# EAGLE schematic BlockBox v2 (EAGLE 9.5.2)

## Sheet 1 of 4: Battery
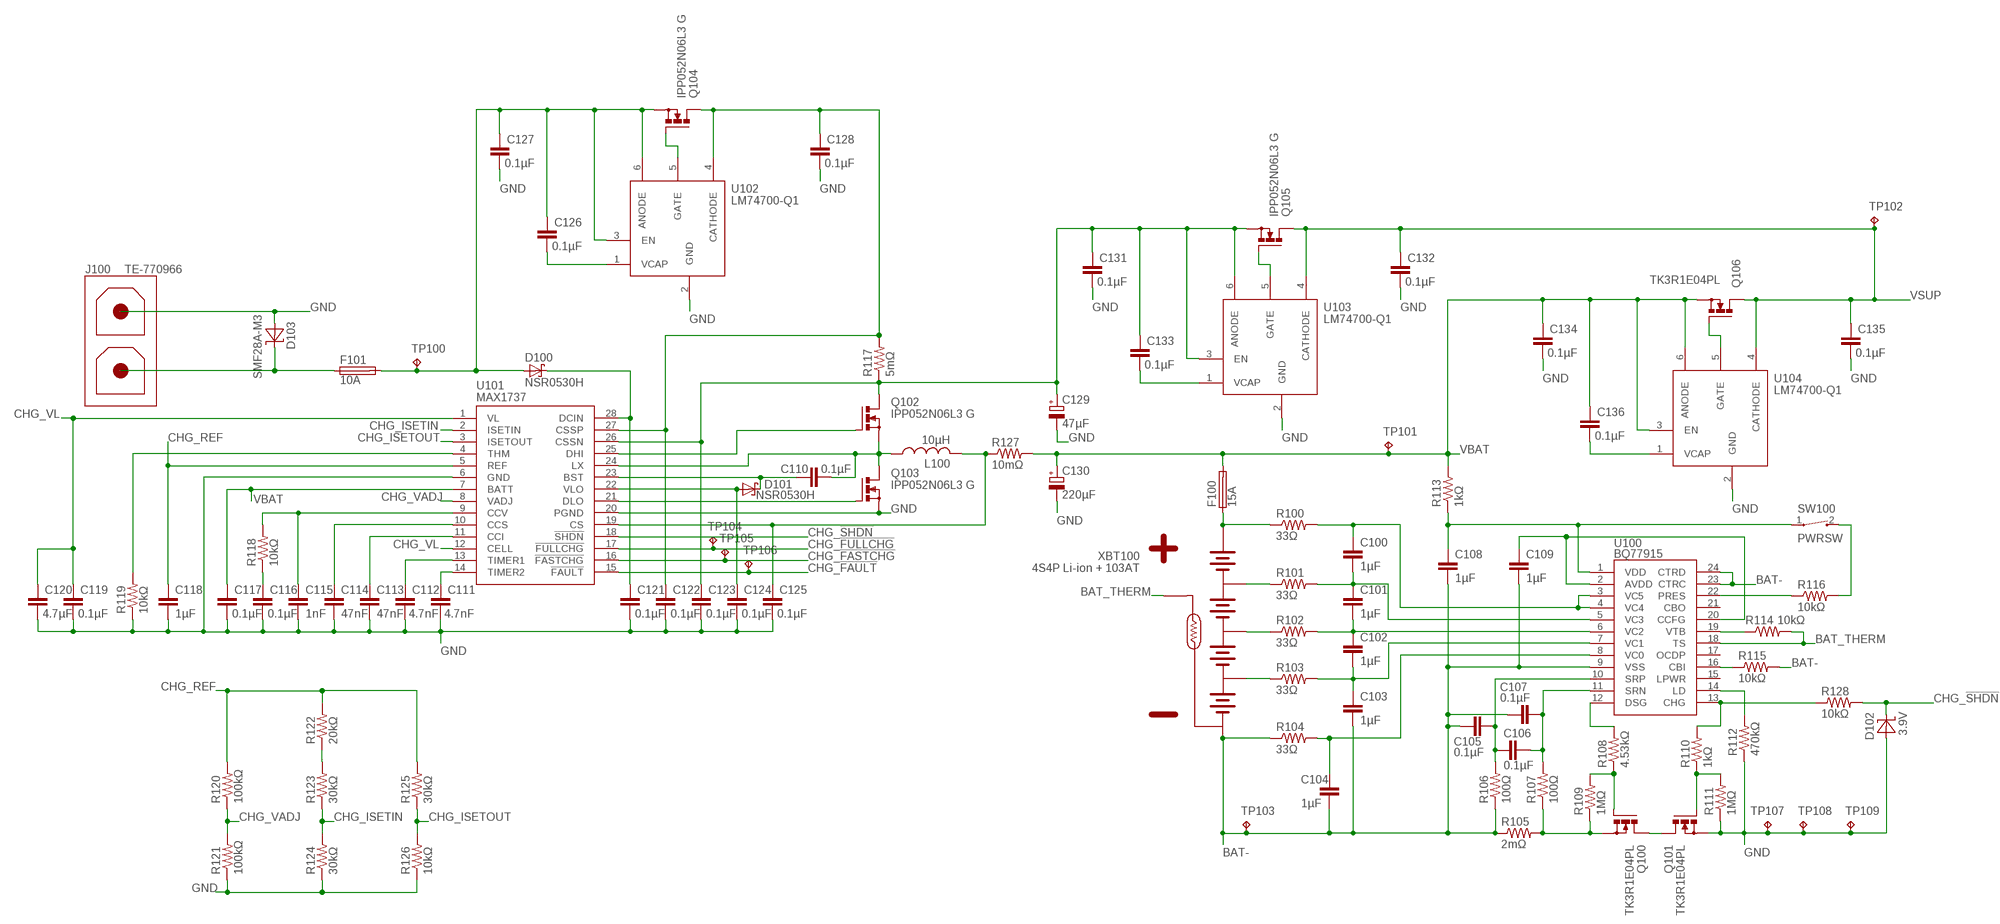
[diagram p0: schematic, sheet 1]

### Parts
C100  1µF  C-EUC0603  [C0603]
C101  1µF  C-EUC0603  [C0603]
C102  1µF  C-EUC0603  [C0603]
C103  1µF  C-EUC0603  [C0603]
C104  1µF  C-EUC0603  [C0603]
C105  0.1µF  C-EUC0603  [C0603]
C106  0.1µF  C-EUC0603  [C0603]
C107  0.1µF  C-EUC0603  [C0603]
C108  1µF  C-EUC0603  [C0603]
C109  1µF  C-EUC0603  [C0603]
C110  0.1µF  C-EUC0603  [C0603]
C111  4.7nF  C-EUC0603  [C0603]
C112  4.7nF  C-EUC0603  [C0603]
C113  47nF  C-EUC0603  [C0603]
C114  47nF  C-EUC0603  [C0603]
C115  1nF  C-EUC0603  [C0603]
C116  0.1µF  C-EUC0603  [C0603]
C117  0.1µF  C-EUC0603  [C0603]
C118  1µF  C-EUC0603  [C0603]
C119  0.1µF  C-EUC0603  [C0603]
C120  4.7µF  C-EUC0805  [C0805]
C121  0.1µF  C-EUC0603  [C0603]
C122  0.1µF  C-EUC0603  [C0603]
C123  0.1µF  C-EUC0603  [C0603]
C124  0.1µF  C-EUC0603  [C0603]
C125  0.1µF  C-EUC0603  [C0603]
C126  0.1µF  C-EUC0603  [C0603]
C127  0.1µF  C-EUC0603  [C0603]
C128  0.1µF  C-EUC0603  [C0603]
C129  47µF  CPOL-EUE2.5-6  [E2,5-6]
C130  220µF  CPOL-EUE3.5-8  [E3,5-8]
C131  0.1µF  C-EUC0603  [C0603]
C132  0.1µF  C-EUC0603  [C0603]
C133  0.1µF  C-EUC0603  [C0603]
C134  0.1µF  C-EUC0603  [C0603]
C135  0.1µF  C-EUC0603  [C0603]
C136  0.1µF  C-EUC0603  [C0603]
D100  NSR0530H  SOD323-SCHOTTKY  [SOD323]
D101  NSR0530H  SOD323-SCHOTTKY  [SOD323]
D102  3.9V  SOD323-ZENER  [SOD323]
D103  SMF28A-M3  DO-219AB-ZENER  [DO-219AB]
F100  15A  2410-FUSE  [F2410]
F101  10A  2410-FUSE  [F2410]
J100  TE-770966  [TE-770966]
L100  10µH  PM5022  [PM5022]
Q100  TK3R1E04PL  TO220BV-HS1-N-MOSFET  [TO220BV-HS1]
Q101  TK3R1E04PL  TO220BV-HS1-N-MOSFET  [TO220BV-HS1]
Q102  IPP052N06L3 G  TO220BV-HS1-N-MOSFET  [TO220BV-HS1]
Q103  IPP052N06L3 G  TO220BV-HS1-N-MOSFET  [TO220BV-HS1]
Q104  IPP052N06L3 G  TO220BV-HS1-N-MOSFET  [TO220BV-HS1]
Q105  IPP052N06L3 G  TO220BV-HS1-N-MOSFET  [TO220BV-HS1]
Q106  TK3R1E04PL  TO220BV-HS1-N-MOSFET  [TO220BV-HS1]
R100  33Ω  R-US_R0603  [R0603]
R101  33Ω  R-US_R0603  [R0603]
R102  33Ω  R-US_R0603  [R0603]
R103  33Ω  R-US_R0603  [R0603]
R104  33Ω  R-US_R0603  [R0603]
R105  2mΩ  R-US_R2512  [R2512]
R106  100Ω  R-US_R0603  [R0603]
R107  100Ω  R-US_R0603  [R0603]
R108  4.53kΩ  R-US_R0603  [R0603]
R109  1MΩ  R-US_R0603  [R0603]
R110  1kΩ  R-US_R0603  [R0603]
R111  1MΩ  R-US_R0603  [R0603]
R112  470kΩ  R-US_R0603  [R0603]
R113  1kΩ  R-US_R0603  [R0603]
R114  10kΩ  R-US_R0603  [R0603]
R115  10kΩ  R-US_R0603  [R0603]
R116  10kΩ  R-US_R0603  [R0603]
R117  5mΩ  R-US_R1206  [R1206]
R118  10kΩ  R-US_R0603  [R0603]
R119  10kΩ  R-US_R0603  [R0603]
R120  100kΩ  R-US_R0603  [R0603]
R121  100kΩ  R-US_R0603  [R0603]
R122  20kΩ  R-US_R0603  [R0603]
R123  30kΩ  R-US_R0603  [R0603]
R124  30kΩ  R-US_R0603  [R0603]
R125  30kΩ  R-US_R0603  [R0603]
R126  10kΩ  R-US_R0603  [R0603]
R127  10mΩ  R-US_R1206  [R1206]
R128  10kΩ  R-US_R0603  [R0603]
SW100  PWRSW  WIRED-SWITCH-NO  [WIRE-2P-SIMPLE]
TP100  TPTP15R  [TP15R]
TP101  TPTP15R  [TP15R]
TP102  TPTP15R  [TP15R]
TP103  TPTP15R  [TP15R]
TP104  TPTP15R  [TP15R]
TP105  TPTP15R  [TP15R]
TP106  TPTP15R  [TP15R]
TP107  TPTP15R  [TP15R]
TP108  TPTP15R  [TP15R]
TP109  TPTP15R  [TP15R]
U100  BQ77915  [TSSOP24]
U101  MAX1737  [QSOP28]
U102  LM74700-Q1  [SOT23-6L]
U103  LM74700-Q1  [SOT23-6L]
U104  LM74700-Q1  [SOT23-6L]
XBT100  4S4P Li-ion + 103AT  LI-ION-PACK-CONN  [TE-770970]

### Nets
BAT-: C103.2 C104.2 C105.1 C107.1 C108.2 C109.2 R104.1 R105.1 R106.1 R115.2 TP103.TP U100.9(VSS) U100.23(CTRC) U100.24(CTRD) XBT100.5(-) XBT100.6(-) ; also sheet 4
BAT-_INT1: Q100.S R105.2 R107.1 R109.1
BAT-_INT2: Q100.D Q101.D
BAT_AVDD: C109.1 U100.2(AVDD) U100.20(CCFG)
BAT_BAL0: C104.1 R104.2 U100.8(VC0)
BAT_BAL1: C102.2 C103.1 R103.2 U100.7(VC1)
BAT_BAL2: C101.2 C102.1 R102.2 U100.6(VC2)
BAT_BAL3: C100.2 C101.1 R101.2 U100.5(VC3)
BAT_BAL4: C100.1 R100.2 U100.3(VC5) U100.4(VC4)
BAT_CBI: R115.1 U100.16(CBI)
BAT_CHG_CTL: R110.2 R128.1 U100.13(CHG)
BAT_CHG_GATE: Q101.G R110.1 R111.2
BAT_CSN: C106.2 C107.2 R107.2 U100.11(SRN) ; also sheet 4
BAT_CSP: C105.2 C106.1 R106.2 U100.10(SRP) ; also sheet 4
BAT_DSG_CTL: R108.2 U100.12(DSG)
BAT_DSG_GATE: Q100.G R108.1 R109.2
BAT_INT1: R103.1 XBT100.4(BAL1)
BAT_INT2: R102.1 XBT100.3(BAL2)
BAT_INT3: R101.1 XBT100.7(BAL3)
BAT_LD: R112.2 U100.14(LD)
BAT_PRES: R116.1 U100.22(PRES)
BAT_PRES_SW: R116.2 SW100.2
BAT_THERM: R114.2 U100.18(TS) XBT100.8(THERM1)
BAT_VDD: C108.1 R113.1 SW100.1 U100.1(VDD)
BAT_VTB: R114.1 U100.19(VTB)
CHG_!FASTCHG: TP105.TP U101.16(!FASTCHG) ; also sheet 4
CHG_!FAULT: TP106.TP U101.15(!FAULT) ; also sheet 4
CHG_!FULLCHG: TP104.TP U101.17(!FULLCHG) ; also sheet 4
CHG_!SHDN: D102.1(C) R128.2 U101.18(!SHDN)
CHG_BST: C110.1 D101.1(C) U101.23(BST)
CHG_CCI: C113.1 U101.11(CCI)
CHG_CCS: C114.1 U101.10(CCS)
CHG_CCV: C115.1 R118.2 U101.9(CCV)
CHG_CCV_FILT: C116.1 R118.1
CHG_CS: C125.1 L100.2 R127.1 U101.19(CS)
CHG_CSSN: C123.1 C129.+ C131.1 C133.1 Q102.D Q105.S R117.1 U101.26(CSSN) U103.3(EN) U103.6(ANODE)
CHG_CSSP: C122.1 C128.1 Q104.D R117.2 U101.27(CSSP) U102.4(CATHODE)
CHG_DCIN: C121.1 D100.1(C) U101.28(DCIN)
CHG_DHI: Q102.G U101.25(DHI)
CHG_DLO: Q103.G U101.21(DLO)
CHG_ISETIN: R123.1 R124.2 U101.2(ISETIN)
CHG_ISETIN_INT: R122.1 R123.2
CHG_ISETOUT: R125.1 R126.2 U101.3(ISETOUT)
CHG_LX: C110.2 L100.1 Q102.S Q103.D U101.24(LX)
CHG_REF: C118.1 R120.2 R122.2 R125.2 U101.5(REF)
CHG_THM: R119.2 U101.4(THM)
CHG_TIMER1: C112.1 U101.13(TIMER1)
CHG_TIMER2: C111.1 U101.14(TIMER2)
CHG_VADJ: R120.1 R121.2 U101.8(VADJ)
CHG_VL: C119.1 C120.1 U101.1(VL) U101.12(CELL)
CHG_VLO: C124.1 D101.2(A) U101.22(VLO)
GND: C111.2 C112.2 C113.2 C114.2 C115.2 C116.2 C117.2 C118.2 C119.2 C120.2 C121.2 C122.2 C123.2 C124.2 C125.2 C127.2 C128.2 C129.- C130.- C131.2 C132.2 C134.2 C135.2 D102.2(A) D103.A J100.2 Q101.S Q103.S R111.1 R112.1 R119.1 R121.1 R124.1 R126.1 TP107.TP TP108.TP TP109.TP U101.6(GND) U101.20(PGND) U102.2(GND) U103.2(GND) U104.2(GND) ; also sheet 2,3,4
VBAT: C117.1 C130.+ C134.1 C136.1 F100.2 Q106.S R113.2 R127.2 TP101.TP U101.7(BATT) U104.3(EN) U104.6(ANODE) ; also sheet 4
VBAT_PREFUSE: F100.1 R100.1 XBT100.1(+) XBT100.2(+)
VIN_EXT: D103.K(C) F101.1 J100.1
VIN_EXT_FUSED: C126.1 C127.1 D100.2(A) F101.2 Q104.S TP100.TP U102.3(EN) U102.6(ANODE)
VIN_ID_GATE: Q104.G U102.5(GATE)
VIN_ID_VCAP: C126.2 U102.1(VCAP)
VSUP: C132.1 C135.1 Q105.D Q106.D TP102.TP U103.4(CATHODE) U104.4(CATHODE) ; also sheet 2
VSUP_ID1_GATE: Q105.G U103.5(GATE)
VSUP_ID1_VCAP: C133.2 U103.1(VCAP)
VSUP_ID2_GATE: Q106.G U104.5(GATE)
VSUP_ID2_VCAP: C136.2 U104.1(VCAP)
Unconnected: U100.15(LPWR) U100.17(OCDP) U100.21(CBO)

## Sheet 2 of 4: Power conversion
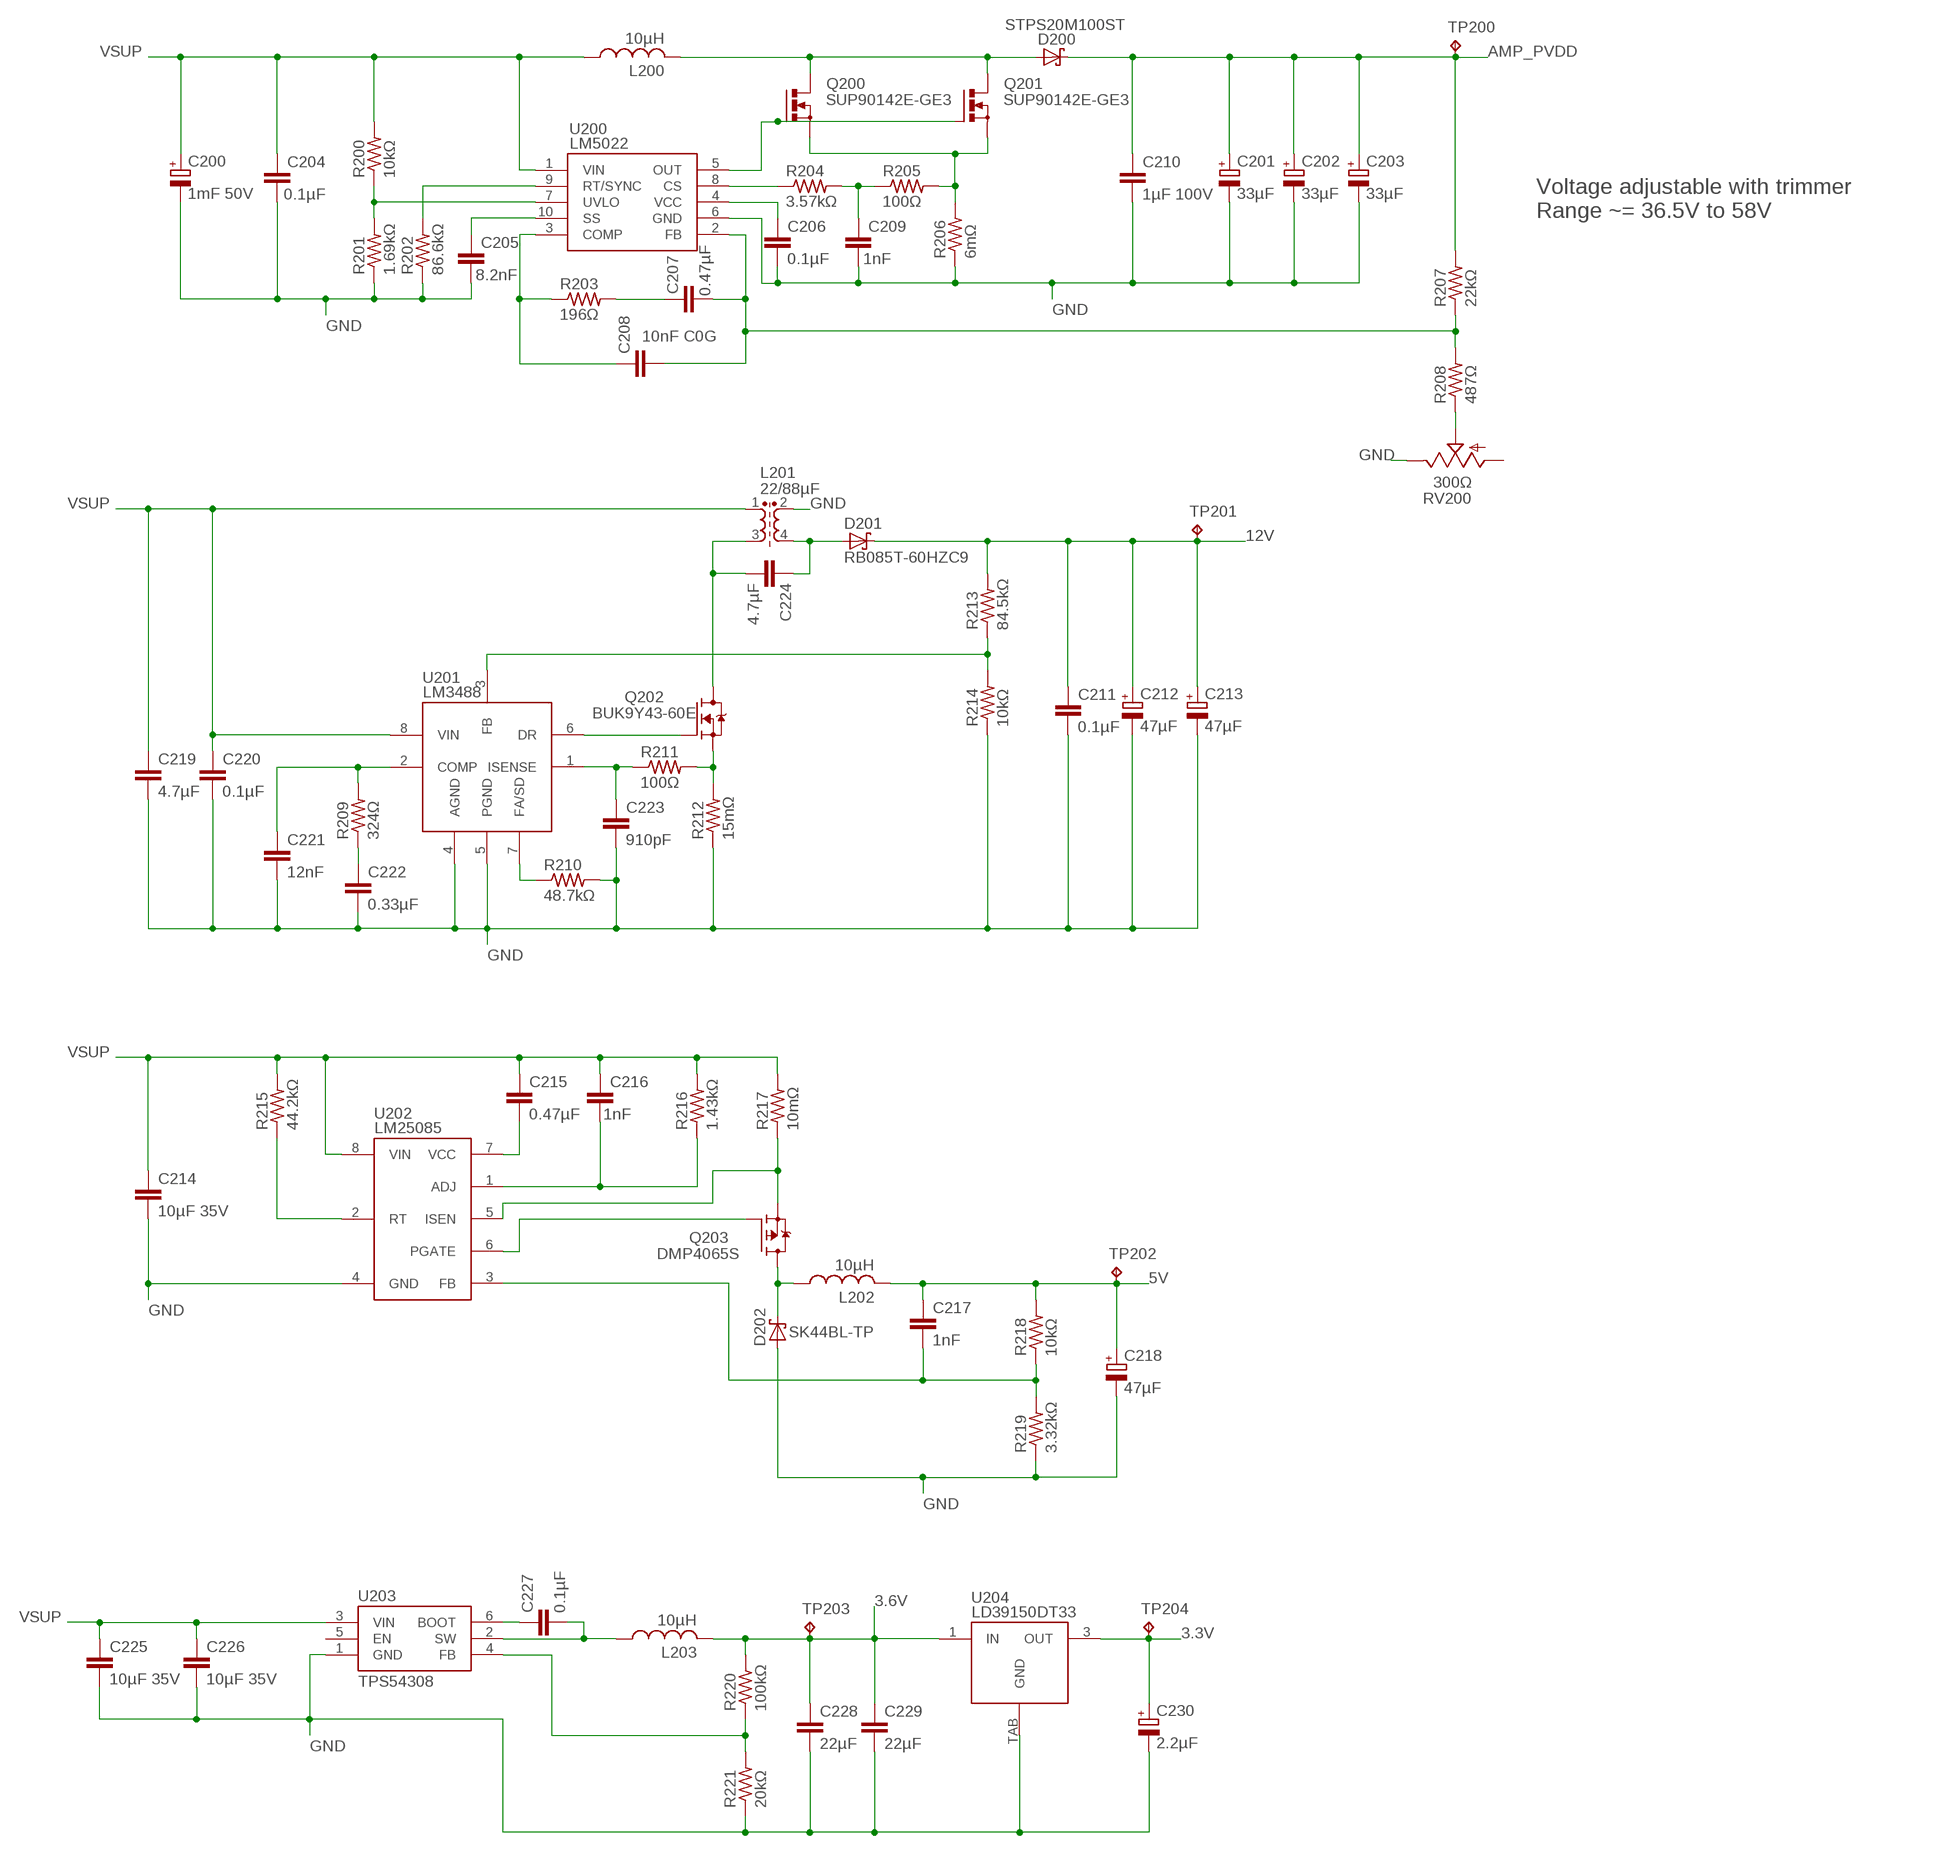
[diagram p1: schematic, sheet 2]

### Parts
C200  1mF 50V  CPOL-EUE7.5-16  [E7,5-16]
C201  33µF  CPOL-EUE3.5-8  [E3,5-8]
C202  33µF  CPOL-EUE3.5-8  [E3,5-8]
C203  33µF  CPOL-EUE3.5-8  [E3,5-8]
C204  0.1µF  C-EUC0603  [C0603]
C205  8.2nF  C-EUC0603  [C0603]
C206  0.1µF  C-EUC0603  [C0603]
C207  0.47µF  C-EU050-035X075  [C050-035X075]
C208  10nF C0G  C-EUC0603  [C0603]
C209  1nF  C-EUC0603  [C0603]
C210  1µF 100V  C-EUC1206  [C1206]
C211  0.1µF  C-EUC0603  [C0603]
C212  47µF  CPOL-EUE2.5-6  [E2,5-6]
C213  47µF  CPOL-EUE2.5-6  [E2,5-6]
C214  10µF 35V  C-EUC1206  [C1206]
C215  0.47µF  C-EUC0603  [C0603]
C216  1nF  C-EUC0603  [C0603]
C217  1nF  C-EUC0603  [C0603]
C218  47µF  CPOL-EUE2.5-6  [E2,5-6]
C219  4.7µF  C-EUC0805  [C0805]
C220  0.1µF  C-EUC0603  [C0603]
C221  12nF  C-EUC0603  [C0603]
C222  0.33µF  C-EU050-035X075  [C050-035X075]
C223  910pF  C-EUC0603  [C0603]
C224  4.7µF  C-EUC0805  [C0805]
C225  10µF 35V  C-EUC1206  [C1206]
C226  10µF 35V  C-EUC1206  [C1206]
C227  0.1µF  C-EUC0603  [C0603]
C228  22µF  C-EUC0805  [C0805]
C229  22µF  C-EUC0805  [C0805]
C230  2.2µF  CPOL-EUB  [PANASONIC_B]
D200  STPS20M100ST  TO220AB-HS1-SCHOTTKY  [TO220ABS-HS1]
D201  RB085T-60HZC9  TO220AB-HS1-SCHOTTKY  [TO220ABS-HS1]
D202  SK44BL-TP  DO-214AA-SCHOTTKY  [DO-214AA]
L200  10µH  PQ2614B  [PQ2614B]
L201  22/88µF  SRF1280A  [SRF1280A]
L202  10µH  SRN1060  [SRN1060]
L203  10µH  RLB0912  [RLB0912]
Q200  SUP90142E-GE3  TO220BV-HS1-N-MOSFET  [TO220BV-HS1]
Q201  SUP90142E-GE3  TO220BV-HS1-N-MOSFET  [TO220BV-HS1]
Q202  BUK9Y43-60E  SOT669-N-MOSFET  [SOT669]
Q203  DMP4065S  SOT23-P-MOSFET  [SOT23]
R200  10kΩ  R-US_R0603  [R0603]
R201  1.69kΩ  R-US_R0603  [R0603]
R202  86.6kΩ  R-US_R0603  [R0603]
R203  196Ω  R-US_R0603  [R0603]
R204  3.57kΩ  R-US_R0603  [R0603]
R205  100Ω  R-US_R0603  [R0603]
R206  6mΩ  R-US_R2512  [R2512]
R207  22kΩ  R-US_R0603  [R0603]
R208  487Ω  R-US_R0603  [R0603]
R209  324Ω  R-US_R0603  [R0603]
R210  48.7kΩ  R-US_R0603  [R0603]
R211  100Ω  R-US_R0603  [R0603]
R212  15mΩ  R-US_R0612  [R0612]
R213  84.5kΩ  R-US_R0603  [R0603]
R214  10kΩ  R-US_R0603  [R0603]
R215  44.2kΩ  R-US_R0603  [R0603]
R216  1.43kΩ  R-US_R0603  [R0603]
R217  10mΩ  R-US_R1206  [R1206]
R218  10kΩ  R-US_R0603  [R0603]
R219  3.32kΩ  R-US_R0603  [R0603]
R220  100kΩ  R-US_R0603  [R0603]
R221  20kΩ  R-US_R0603  [R0603]
RV200  300Ω  TC33X-2  [TC33X-2]
TP200  TPTP15R  [TP15R]
TP201  TPTP15R  [TP15R]
TP202  TPTP15R  [TP15R]
TP203  TPTP15R  [TP15R]
TP204  TPTP15R  [TP15R]
U200  LM5022  [VSSOP10]
U201  LM3488  [VSSOP8]
U202  LM25085  [VSSOP8]
U203  TPS54308  [SOT23-6L]
U204  LD39150DT33  DPAK-LDO  [DPAK]

### Nets
3.3V: C230.+ TP204.TP U204.3(OUT) ; also sheet 3,4
3.6V: C228.1 C229.1 L203.2 R220.2 TP203.TP U204.1(IN)
5V: C217.1 C218.+ L202.2 R218.2 TP202.TP ; also sheet 4
12V: C211.1 C212.+ C213.+ D201.C R213.2 TP201.TP ; also sheet 3,4
AMP_PVDD: C201.+ C202.+ C203.+ C210.1 D200.C R207.2 TP200.TP ; also sheet 3
BOOST_COMP: C208.1 R203.1 U200.3(COMP)
BOOST_COMP_INT: C207.1 R203.2
BOOST_CS: R204.1 U200.8(CS)
BOOST_CS_FILTER: C209.1 R204.2 R205.1
BOOST_FB: C207.2 C208.2 R207.1 R208.2 U200.2(FB)
BOOST_FB_ADJ: R208.1 RV200.2(S)
BOOST_RT: R202.2 U200.9(RT/SYNC)
BOOST_SS: C205.1 U200.10(SS)
BOOST_SW_DRAIN: D200.A1(A) D200.A2(A) L200.2 Q200.D Q201.D
BOOST_SW_GATE: Q200.G Q201.G U200.5(OUT)
BOOST_SW_SOURCE: Q200.S Q201.S R205.2 R206.2
BOOST_UVLO: R200.1 R201.2 U200.7(UVLO)
BOOST_VCC: C206.1 U200.4(VCC)
BUCK_ADJ: C216.2 R216.1 U202.1(ADJ)
BUCK_FB: C217.2 R218.1 R219.2 U202.3(FB)
BUCK_RT: R215.1 U202.2(RT)
BUCK_SW_DRAIN: Q203.2(S) R217.1 U202.5(ISEN)
BUCK_SW_GATE: Q203.1(G) U202.6(PGATE)
BUCK_SW_SOURCE: D202.K(C) L202.1 Q203.3(D)
BUCK_VCC: C215.2 U202.7(VCC)
GND: C200.- C201.- C202.- C203.- C204.2 C205.2 C206.2 C209.2 C210.2 C211.2 C212.- C213.- C214.2 C218.- C219.2 C220.2 C221.2 C222.2 C223.2 C225.2 C226.2 C228.2 C229.2 C230.- D202.A L201.2(S1) R201.1 R202.1 R206.1 R210.2 R212.1 R214.1 R219.1 R221.1 RV200.3(E) U200.6(GND) U201.4(AGND) U201.5(PGND) U202.4(GND) U203.1(GND) U204.TAB(GND) ; also sheet 1,3,4
PRELIN_BOOT: C227.1 U203.6(BOOT)
PRELIN_FB: R220.1 R221.2 U203.4(FB)
PRELIN_SW: C227.2 L203.1 U203.2(SW)
SEPIC_COMP: C221.1 R209.2 U201.2(COMP)
SEPIC_COMP_INT: C222.1 R209.1
SEPIC_FA: R210.1 U201.7(FA/SD)
SEPIC_FB: R213.1 R214.2 U201.3(FB)
SEPIC_ISENSE: C223.1 R211.1 U201.1(ISENSE)
SEPIC_PREDIODE: C224.1 D201.A1(A) D201.A2(A) L201.4(S2)
SEPIC_SW_DRAIN: C224.2 L201.3(P2) Q202.MB(D)
SEPIC_SW_GATE: Q202.4(G) U201.6(DR)
SEPIC_SW_SOURCE: Q202.1(S) Q202.2(S) Q202.3(S) R211.2 R212.2
VSUP: C200.+ C204.1 C214.1 C215.1 C216.1 C219.1 C220.1 C225.1 C226.1 L200.1 L201.1 R200.2 R215.2 R216.2 R217.2 U200.1(VIN) U201.8(VIN) U202.8(VIN) U203.3(VIN) ; also sheet 1
Unconnected: RV200.1(A) U203.5(EN)

### Notes on the sheet
- Voltage adjustable with trimmer
  Range ~= 36.5V to 58V

## Sheet 3 of 4: Audio path
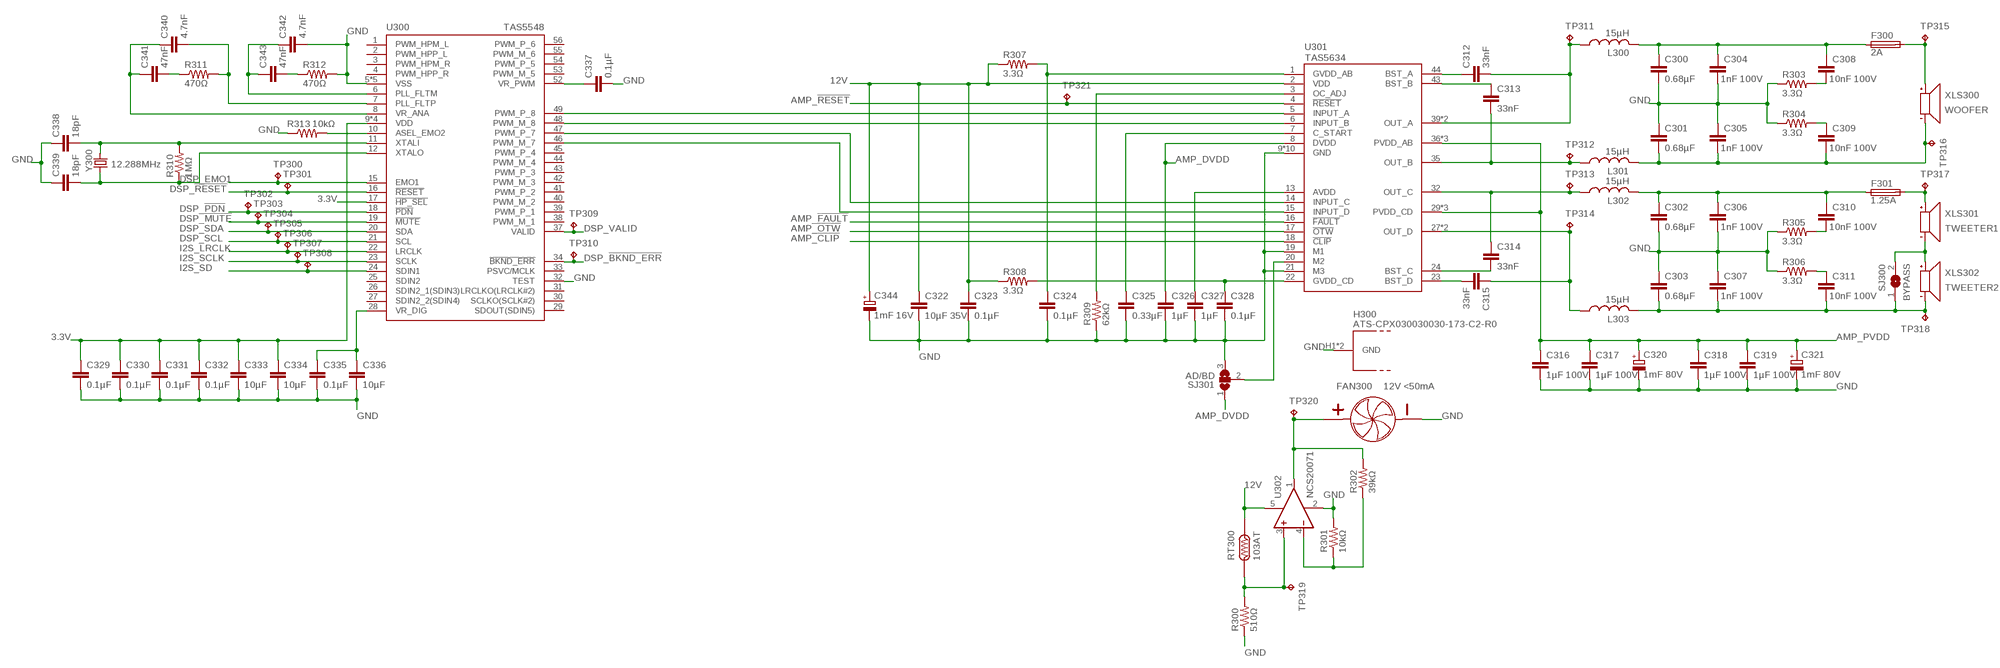
[diagram p2: schematic, sheet 3]

### Parts
C300  0.68µF  C-EU150-064X183  [C150-064X183]
C301  0.68µF  C-EU150-064X183  [C150-064X183]
C302  0.68µF  C-EU150-064X183  [C150-064X183]
C303  0.68µF  C-EU150-064X183  [C150-064X183]
C304  1nF 100V  C-EUC0603  [C0603]
C305  1nF 100V  C-EUC0603  [C0603]
C306  1nF 100V  C-EUC0603  [C0603]
C307  1nF 100V  C-EUC0603  [C0603]
C308  10nF 100V  C-EUC0603  [C0603]
C309  10nF 100V  C-EUC0603  [C0603]
C310  10nF 100V  C-EUC0603  [C0603]
C311  10nF 100V  C-EUC0603  [C0603]
C312  33nF  C-EUC0805  [C0805]
C313  33nF  C-EUC0805  [C0805]
C314  33nF  C-EUC0805  [C0805]
C315  33nF  C-EUC0805  [C0805]
C316  1µF 100V  C-EUC1206  [C1206]
C317  1µF 100V  C-EUC1206  [C1206]
C318  1µF 100V  C-EUC1206  [C1206]
C319  1µF 100V  C-EUC1206  [C1206]
C320  1mF 80V  CPOL-EUE7.5-16  [E7,5-16]
C321  1mF 80V  CPOL-EUE7.5-16  [E7,5-16]
C322  10µF 35V  C-EUC1206  [C1206]
C323  0.1µF  C-EUC0603  [C0603]
C324  0.1µF  C-EUC0603  [C0603]
C325  0.33µF  C-EUC0603  [C0603]
C326  1µF  C-EUC0603  [C0603]
C327  1µF  C-EUC0603  [C0603]
C328  0.1µF  C-EUC0603  [C0603]
C329  0.1µF  C-EUC0603  [C0603]
C330  0.1µF  C-EUC0603  [C0603]
C331  0.1µF  C-EUC0603  [C0603]
C332  0.1µF  C-EUC0603  [C0603]
C333  10µF  C-EUC0805  [C0805]
C334  10µF  C-EUC0805  [C0805]
C335  0.1µF  C-EUC0603  [C0603]
C336  10µF  C-EUC0805  [C0805]
C337  0.1µF  C-EUC0603  [C0603]
C338  18pF  C-EUC0603  [C0603]
C339  18pF  C-EUC0603  [C0603]
C340  4.7nF  C-EUC0603  [C0603]
C341  47nF  C-EUC0603  [C0603]
C342  4.7nF  C-EUC0603  [C0603]
C343  47nF  C-EUC0603  [C0603]
C344  1mF 16V  CPOL-EUE5-10.5  [E5-10,5]
F300  2A  MRF_FUSE  [MRF_FUSE]
F301  1.25A  MRF_FUSE  [MRF_FUSE]
FAN300  12V <50mA  WIRED-FAN  [WIRE-2P-SIMPLE]
H300  ATS-CPX030030030-173-C2-R0  [ATS-CPX030030030-173-C2-R0]
L300  15µH  1D14A  [1D14A]
L301  15µH  1D14A  [1D14A]
L302  15µH  1D14A  [1D14A]
L303  15µH  1D14A  [1D14A]
R300  510Ω  R-US_R0603  [R0603]
R301  10kΩ  R-US_R0603  [R0603]
R302  39kΩ  R-US_R0603  [R0603]
R303  3.3Ω  R-US_R0805  [R0805]
R304  3.3Ω  R-US_R0805  [R0805]
R305  3.3Ω  R-US_R0805  [R0805]
R306  3.3Ω  R-US_R0805  [R0805]
R307  3.3Ω  R-US_R0805  [R0805]
R308  3.3Ω  R-US_R0805  [R0805]
R309  62kΩ  R-US_R0603  [R0603]
R310  1MΩ  R-US_R0603  [R0603]
R311  470Ω  R-US_R0603  [R0603]
R312  470Ω  R-US_R0603  [R0603]
R313  10kΩ  R-US_R0603  [R0603]
RT300  103AT  WIRED-THERMISTOR  [WIRE-2P-SIMPLE]
SJ300  BYPASS  SJ  [SJ]
SJ301  AD/BD  SJ2W  [SJ_2]
TP300  TPTP15R  [TP15R]
TP301  TPTP15R  [TP15R]
TP302  TPTP15R  [TP15R]
TP303  TPTP15R  [TP15R]
TP304  TPTP15R  [TP15R]
TP305  TPTP15R  [TP15R]
TP306  TPTP15R  [TP15R]
TP307  TPTP15R  [TP15R]
TP308  TPTP15R  [TP15R]
TP309  TPTP15R  [TP15R]
TP310  TPTP15R  [TP15R]
TP311  TPTP15R  [TP15R]
TP312  TPTP15R  [TP15R]
TP313  TPTP15R  [TP15R]
TP314  TPTP15R  [TP15R]
TP315  TPTP15R  [TP15R]
TP316  TPTP15R  [TP15R]
TP317  TPTP15R  [TP15R]
TP318  TPTP15R  [TP15R]
TP319  TPTP15R  [TP15R]
TP320  TPTP15R  [TP15R]
TP321  TPTP15R  [TP15R]
U300  TAS5548  [HTSSOP56DCA]
U301  TAS5634  [TSSOP44]
U302  NCS20071  [TSOP-5]
XLS300  WOOFER  SPEAKER-CONN  [TE-770966]
XLS301  TWEETER1  SPEAKER-CONN  [TE-770966]
XLS302  TWEETER2  SPEAKER-CONN  [TE-770966]
Y300  12.288MHz  HC49US-CRYSTAL  [HC49US]

### Nets
3.3V: C329.1 C330.1 C331.1 C332.1 C333.1 C334.1 U300.9(VDD) U300.14(VDD) U300.17(!HP_SEL) U300.35(VDD) U300.50(VDD) ; also sheet 2,4
12V: C322.1 C323.1 C344.+ R307.1 R308.1 RT300.1 U301.2(VDD) U302.5(V+) ; also sheet 2,4
AMP_!CLIP: U301.18(!CLIP) ; also sheet 4
AMP_!FAULT: U301.16(!FAULT) ; also sheet 4
AMP_!OTW: U301.17(!OTW) ; also sheet 4
AMP_!RESET: TP321.TP U301.4(!RESET) ; also sheet 4
AMP_A_FILT: C300.1 C304.1 C308.1 F300.1 L300.2
AMP_A_FILT_INT: C308.2 R303.2
AMP_A_FUSED: F300.2 TP315.TP XLS300.2(+)
AMP_AVDD: C327.1 U301.13(AVDD)
AMP_B_FILT: C301.1 C305.2 C309.2 L301.2 TP316.TP XLS300.1(-)
AMP_B_FILT_INT: C309.1 R304.2
AMP_BST_A: C312.1 U301.44(BST_A)
AMP_BST_B: C313.1 U301.43(BST_B)
AMP_BST_C: C314.2 U301.24(BST_C)
AMP_BST_D: C315.2 U301.23(BST_D)
AMP_C_FILT: C302.1 C306.1 C310.1 F301.1 L302.2
AMP_C_FILT_INT: C310.2 R305.2
AMP_C_FUSED: F301.2 TP317.TP XLS301.2(+)
AMP_C_START: C325.1 U301.7(C_START)
AMP_CD_MID: SJ300.2 XLS301.1(-) XLS302.2(+)
AMP_D_FILT: C303.1 C307.2 C311.2 L303.2 SJ300.1 TP318.TP XLS302.1(-)
AMP_D_FILT_INT: C311.1 R306.2
AMP_DVDD: C326.1 SJ301.1 U301.8(DVDD)
AMP_FAN_+: FAN300.1(+) R302.2 TP320.TP U302.1(OUT)
AMP_FAN_FB: R301.1 R302.1 U302.4(-IN)
AMP_FAN_SENSE: R300.2 RT300.2 TP319.TP U302.3(+IN)
AMP_GVDD_AB: C324.1 R307.2 U301.1(GVDD_AB)
AMP_GVDD_CD: C328.1 R308.2 U301.22(GVDD_CD)
AMP_INPUT_A: U300.49(PWM_P_8) U301.5(INPUT_A)
AMP_INPUT_B: U300.48(PWM_M_8) U301.6(INPUT_B)
AMP_INPUT_C: U300.47(PWM_P_7) U301.14(INPUT_C)
AMP_INPUT_D: U300.46(PWM_M_7) U301.15(INPUT_D)
AMP_M2: SJ301.2 U301.20(M2)
AMP_OC_ADJ: R309.2 U301.3(OC_ADJ)
AMP_OUT_A: C312.2 L300.1 TP311.TP U301.39(OUT_A) U301.40(OUT_A)
AMP_OUT_B: C313.2 L301.1 TP312.TP U301.35(OUT_B)
AMP_OUT_C: C314.1 L302.1 TP313.TP U301.32(OUT_C)
AMP_OUT_D: C315.1 L303.1 TP314.TP U301.27(OUT_D) U301.28(OUT_D)
AMP_PVDD: C316.1 C317.1 C318.1 C319.1 C320.+ C321.+ U301.29(PVDD_CD) U301.30(PVDD_CD) U301.31(PVDD_CD) U301.36(PVDD_AB) U301.37(PVDD_AB) U301.38(PVDD_AB) ; also sheet 2
DSP_!BKND_ERR: TP310.TP U300.34(!BKND_ERR) ; also sheet 4
DSP_!MUTE: TP303.TP U300.19(!MUTE) ; also sheet 4
DSP_!PDN: TP302.TP U300.18(!PDN) ; also sheet 4
DSP_!RESET: TP301.TP U300.16(!RESET) ; also sheet 4
DSP_ASEL_EMO2: R313.2 U300.10(ASEL_EMO2)
DSP_EMO1: TP300.TP U300.15(EMO1) ; also sheet 4
DSP_PLL_FLTM: C342.1 C343.1 U300.6(PLL_FLTM)
DSP_PLL_FLTP: C340.2 R311.2 U300.7(PLL_FLTP)
DSP_PLL_FLTP_INT: C341.2 R311.1
DSP_PLL_FPLM_INT: C343.2 R312.1
DSP_SCL: TP305.TP U300.21(SCL) ; also sheet 4
DSP_SDA: TP304.TP U300.20(SDA) ; also sheet 4
DSP_VALID: TP309.TP U300.37(VALID) ; also sheet 4
DSP_VR_ANA: C340.1 C341.1 U300.8(VR_ANA)
DSP_VR_DIG: C335.1 C336.1 U300.28(VR_DIG)
DSP_VR_PWM: C337.1 U300.52(VR_PWM)
DSP_XTALI: C338.2 R310.2 U300.11(XTALI) Y300.2
DSP_XTALO: C339.2 R310.1 U300.12(XTALO) Y300.1
GND: C300.2 C301.2 C302.2 C303.2 C304.2 C305.1 C306.2 C307.1 C316.2 C317.2 C318.2 C319.2 C320.- C321.- C322.2 C323.2 C324.2 C325.2 C326.2 C327.2 C328.2 C329.2 C330.2 C331.2 C332.2 C333.2 C334.2 C335.2 C336.2 C337.2 C338.1 C339.1 C342.2 C344.- FAN300.2(-) H300.H1(GND) H300.H2(GND) R300.1 R301.2 R303.1 R304.1 R305.1 R306.1 R309.1 R312.2 R313.1 SJ301.3 U300.5(VSS) U300.13(VSS) U300.32(TEST) U300.36(VSS) U300.51(VSS) U300.EXP(VSS) U301.9(GND) U301.10(GND) U301.11(GND) U301.12(GND) U301.19(M1) U301.21(M3) U301.25(GND) U301.26(GND) U301.33(GND) U301.34(GND) U301.41(GND) U301.42(GND) U302.2(V-) ; also sheet 1,2,4
I2S_LRCLK: TP306.TP U300.22(LRCLK) ; also sheet 4
I2S_SCLK: TP307.TP U300.23(SCLK) ; also sheet 4
I2S_SD: TP308.TP U300.24(SDIN1) ; also sheet 4
Unconnected: U300.1(PWM_HPM_L) U300.2(PWM_HPP_L) U300.3(PWM_HPM_R) U300.4(PWM_HPP_R) U300.25(SDIN2) U300.26(SDIN2_1(SDIN3)) U300.27(SDIN2_2(SDIN4)) U300.29(SDOUT(SDIN5)) U300.30(SCLKO(SCLK#2)) U300.31(LRCLKO(LRCLK#2)) U300.33(PSVC/MCLK) U300.38(PWM_M_1) U300.39(PWM_P_1) U300.40(PWM_M_2) U300.41(PWM_P_2) U300.42(PWM_M_3) U300.43(PWM_P_3) U300.44(PWM_M_4) U300.45(PWM_P_4) U300.53(PWM_M_5) U300.54(PWM_P_5) U300.55(PWM_M_6) U300.56(PWM_P_6)

## Sheet 4 of 4: Control
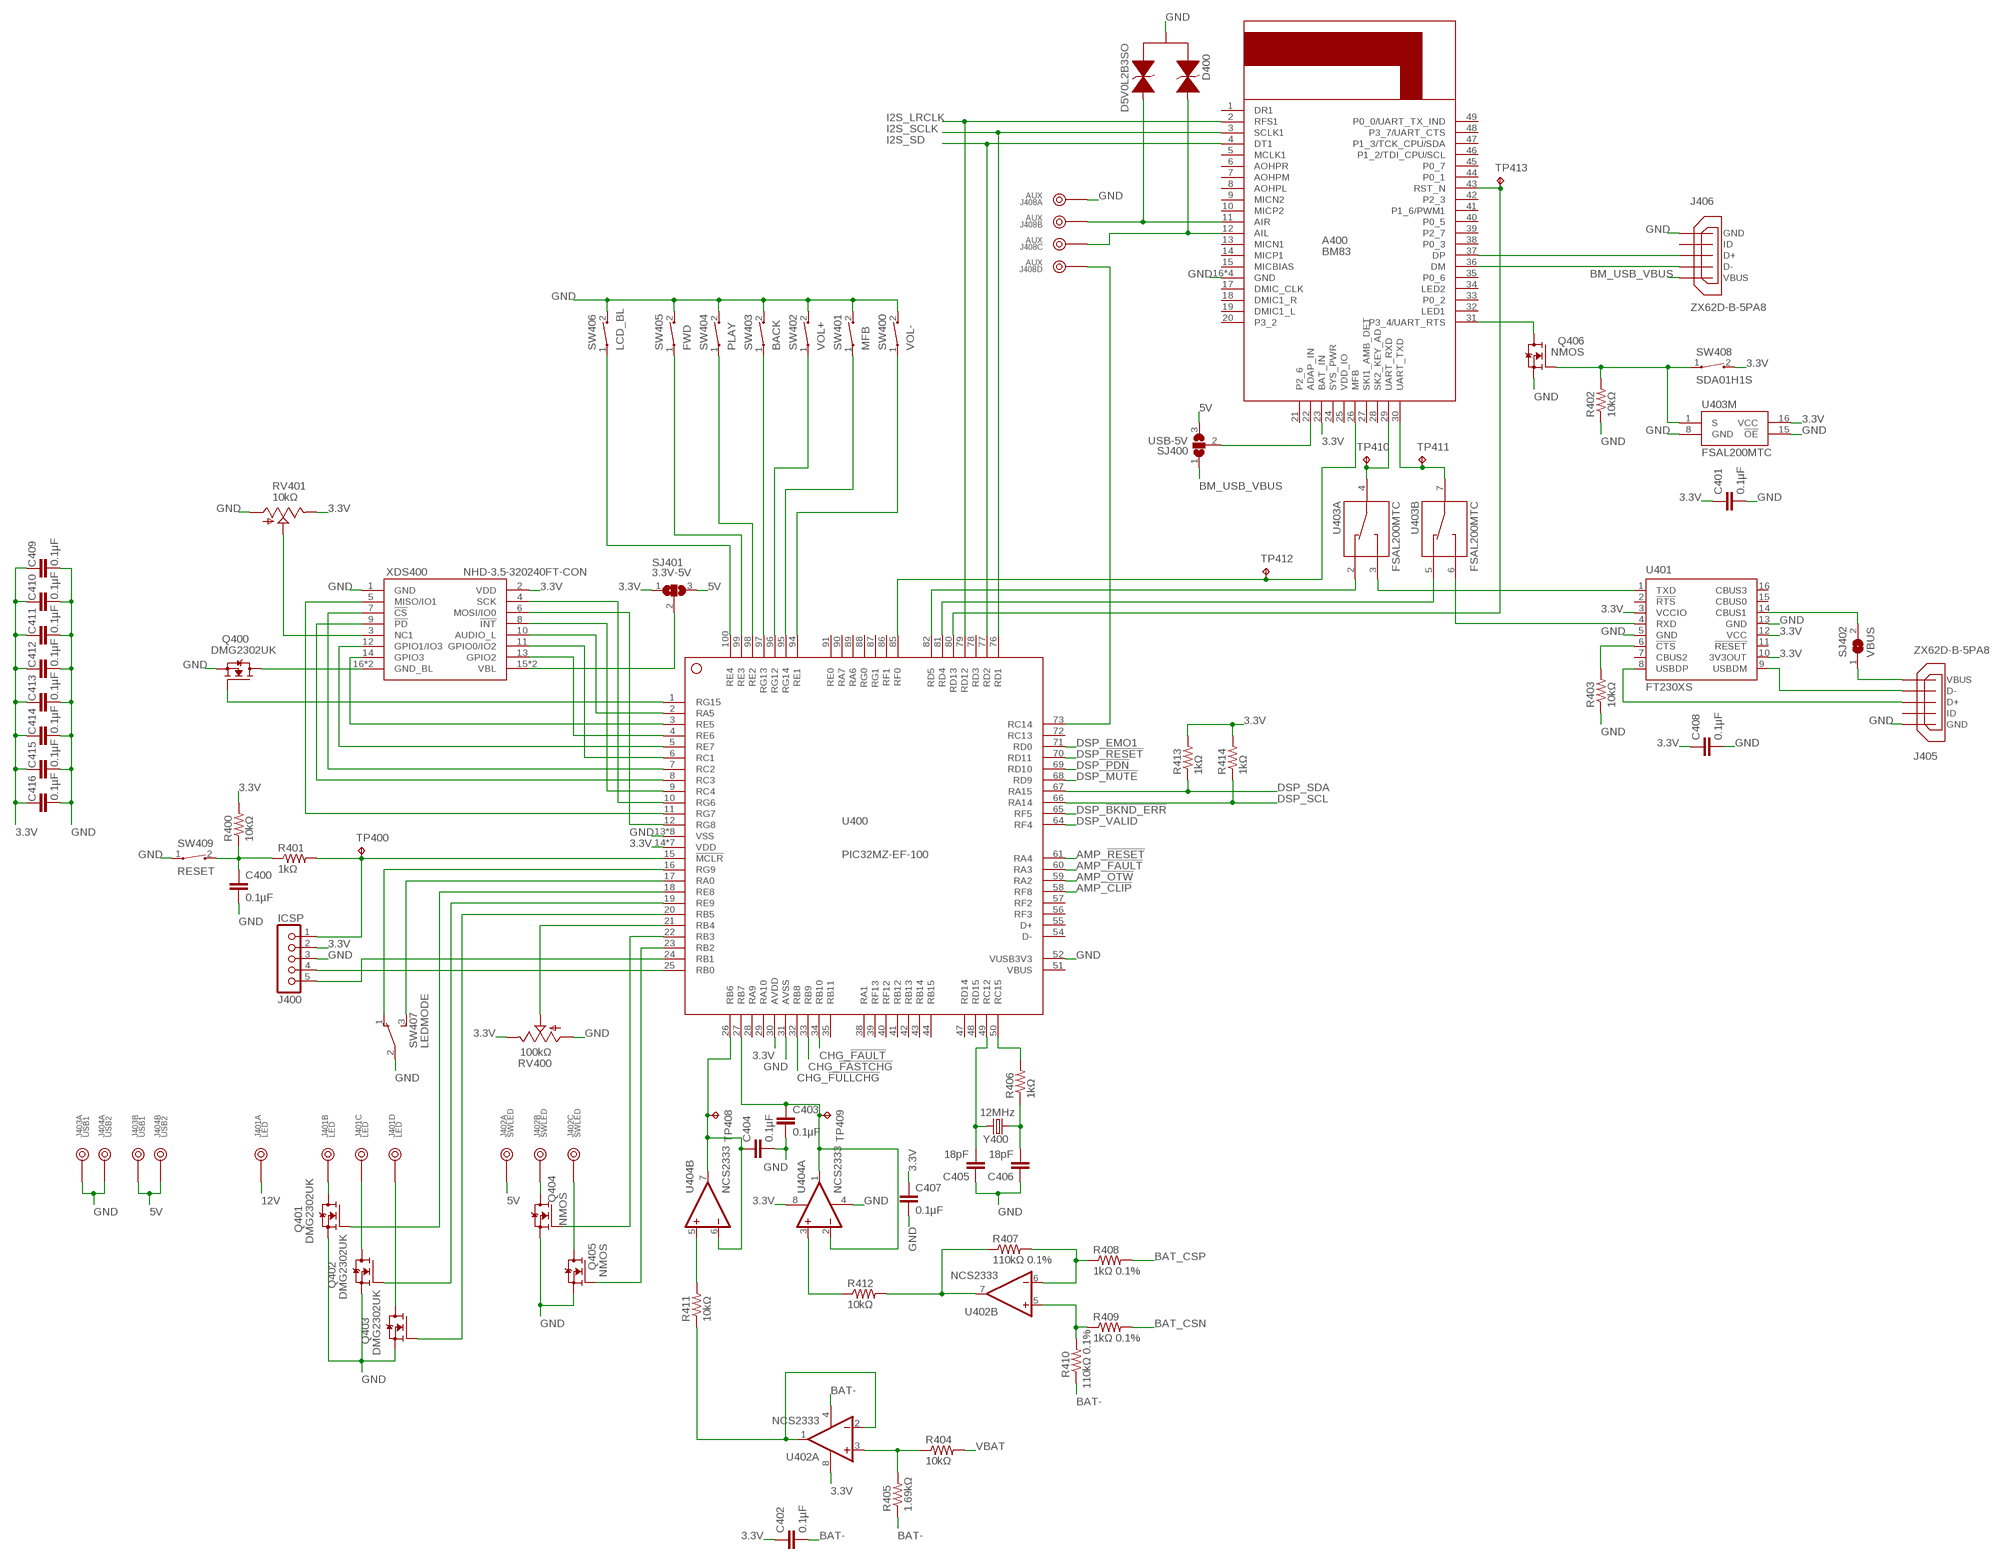
[diagram p3: schematic, sheet 4]

### Parts
A400  BM83  [BM83]
C400  0.1µF  C-EUC0603  [C0603]
C401  0.1µF  C-EUC0603  [C0603]
C402  0.1µF  C-EUC0603  [C0603]
C403  0.1µF  C-EUC0603  [C0603]
C404  0.1µF  C-EUC0603  [C0603]
C405  18pF  C-EUC0603  [C0603]
C406  18pF  C-EUC0603  [C0603]
C407  0.1µF  C-EUC0603  [C0603]
C408  0.1µF  C-EUC0603  [C0603]
C409  0.1µF  C-EUC0603  [C0603]
C410  0.1µF  C-EUC0603  [C0603]
C411  0.1µF  C-EUC0603  [C0603]
C412  0.1µF  C-EUC0603  [C0603]
C413  0.1µF  C-EUC0603  [C0603]
C414  0.1µF  C-EUC0603  [C0603]
C415  0.1µF  C-EUC0603  [C0603]
C416  0.1µF  C-EUC0603  [C0603]
D400  D5V0L2B3SO  SOT23-TVS  [SOT23]
J400  ICSP  5P-1.27-POGO  [5P-1.27-POGO]
J401  LED  GEN-4PIN  [4PIN]
J402  SWLED  GEN-3PIN  [3PIN]
J403  USB1  GEN-2PIN  [2PIN]
J404  USB2  GEN-2PIN  [2PIN]
J405  ZX62D-B-5PA8  [ZX62D-B-5PA8]
J406  ZX62D-B-5PA8  [ZX62D-B-5PA8]
J408  AUX  GEN-4PIN  [4PIN]
Q400  DMG2302UK  SOT23-N-MOSFET  [SOT23]
Q401  DMG2302UK  SOT23-N-MOSFET  [SOT23]
Q402  DMG2302UK  SOT23-N-MOSFET  [SOT23]
Q403  DMG2302UK  SOT23-N-MOSFET  [SOT23]
Q404  NMOS  SOT23-N-MOSFET  [SOT23]
Q405  NMOS  SOT23-N-MOSFET  [SOT23]
Q406  NMOS  SOT23-N-MOSFET  [SOT23]
R400  10kΩ  R-US_R0603  [R0603]
R401  1kΩ  R-US_R0603  [R0603]
R402  10kΩ  R-US_R0603  [R0603]
R403  10kΩ  R-US_R0603  [R0603]
R404  10kΩ  R-US_R0603  [R0603]
R405  1.69kΩ  R-US_R0603  [R0603]
R406  1kΩ  R-US_R0603  [R0603]
R407  110kΩ 0.1%  R-US_R0603  [R0603]
R408  1kΩ 0.1%  R-US_R0603  [R0603]
R409  1kΩ 0.1%  R-US_R0603  [R0603]
R410  110kΩ 0.1%  R-US_R0603  [R0603]
R411  10kΩ  R-US_R0603  [R0603]
R412  10kΩ  R-US_R0603  [R0603]
R413  1kΩ  R-US_R0603  [R0603]
R414  1kΩ  R-US_R0603  [R0603]
RV400  100kΩ  WIRED-POTENTIOMETER  [WIRE-3P-SIMPLE]
RV401  10kΩ  TC33X-2  [TC33X-2]
SJ400  USB-5V  SJ2W  [SJ_2]
SJ401  3.3V-5V  SJ2W  [SJ_2]
SJ402  VBUS  SJ  [SJ]
SW400  VOL-  WIRED-SWITCH-NO  [WIRE-2P-SIMPLE]
SW401  MFB  WIRED-SWITCH-NO  [WIRE-2P-SIMPLE]
SW402  VOL+  WIRED-SWITCH-NO  [WIRE-2P-SIMPLE]
SW403  BACK  WIRED-SWITCH-NO  [WIRE-2P-SIMPLE]
SW404  PLAY  WIRED-SWITCH-NO  [WIRE-2P-SIMPLE]
SW405  FWD  WIRED-SWITCH-NO  [WIRE-2P-SIMPLE]
SW406  LCD_BL  WIRED-SWITCH-NO  [WIRE-2P-SIMPLE]
SW407  LEDMODE  WIRED-SWITCH-U  [WIRE-3P-SIMPLE]
SW408  SDA01H1S  [SDA01H1S]
SW409  RESET  WIRED-SWITCH-NO  [WIRE-2P-SIMPLE]
TP400  TPTP15R  [TP15R]
TP408  TPTP15R  [TP15R]
TP409  TPTP15R  [TP15R]
TP410  TPTP15R  [TP15R]
TP411  TPTP15R  [TP15R]
TP412  TPTP15R  [TP15R]
TP413  TPTP15R  [TP15R]
U400  PIC32MZ-EF-100  PIC32MZ-EF-100-I/PF  [TQFP100-14X14X1MM]
U401  FT230XS  [SSOP16]
U402  NCS2333  [MSOP8]
U403  FSAL200MTC  [TSSOP16L]
U404  NCS2333  [MSOP8]
XDS400  NHD-3.5-320240FT-CON  [2X9PIN]
Y400  12MHz  HC49US-CRYSTAL  [HC49US]

### Nets
3.3V: A400.23(BAT_IN) C401.1 C402.1 C407.1 C408.1 C409.1 C410.1 C411.1 C412.1 C413.1 C414.1 C415.1 C416.1 J400.2 R400.2 R413.2 R414.2 RV400.3(E) RV401.3(E) SJ401.1 SW408.2 U400.14(VDD) U400.30(AVDD) U400.37(VDD) U400.46(VDD) U400.62(VDD) U400.74(VDD) U400.83(VDD) U400.93(VDD) U401.3(VCCIO) U401.10(3V3OUT) U401.12(VCC) U402.8(A:V+) U403.16(M:VCC) U404.8(A:V+) XDS400.2(VDD) ; also sheet 2,3
5V: J402.1 J403.2 J404.2 SJ400.3 SJ401.3 ; also sheet 2
12V: J401.1 ; also sheet 2,3
AMP_!CLIP: U400.58(RF8) ; also sheet 3
AMP_!FAULT: U400.60(RA3) ; also sheet 3
AMP_!OTW: U400.59(RA2) ; also sheet 3
AMP_!RESET: U400.61(RA4) ; also sheet 3
BAT-: C402.2 R405.1 R410.1 U402.4(A:V-) ; also sheet 1
BAT_CSN: R409.2 ; also sheet 1
BAT_CSP: R408.2 ; also sheet 1
BM_!RST: A400.43(RST_N) TP413.TP U400.80(RD13)
BM_ADAP_IN: A400.22(ADAP_IN) SJ400.2
BM_AUX_L: A400.12(AIL) D400.1 J408.3
BM_AUX_R: A400.11(AIR) D400.2 J408.2
BM_MFB: A400.26(MFB) TP412.TP U400.85(RF0)
BM_P3_4: A400.31(P3_4/UART_RTS) Q406.3(D)
BM_UART_RXD: A400.29(UART_RXD) TP410.TP U403.4(A:A)
BM_UART_SWITCH: Q406.1(G) R402.2 SW408.1 U403.1(M:S)
BM_UART_TXD: A400.30(UART_TXD) TP411.TP U403.7(B:A)
BM_USB_D+: A400.37(DP) J406.3(D+)
BM_USB_D-: A400.36(DM) J406.2(D-)
BM_USB_VBUS: J406.1(VBUS) SJ400.1
CHG_!FASTCHG: U400.33(RB9) ; also sheet 1
CHG_!FAULT: U400.34(RB10) ; also sheet 1
CHG_!FULLCHG: U400.32(RB8) ; also sheet 1
DSP_!BKND_ERR: U400.65(RF5) ; also sheet 3
DSP_!MUTE: U400.68(RD9) ; also sheet 3
DSP_!PDN: U400.69(RD10) ; also sheet 3
DSP_!RESET: U400.70(RD11) ; also sheet 3
DSP_EMO1: U400.71(RD0) ; also sheet 3
DSP_SCL: R414.1 U400.66(RA14) ; also sheet 3
DSP_SDA: R413.1 U400.67(RA15) ; also sheet 3
DSP_VALID: U400.64(RF4) ; also sheet 3
FT_!CTS: R403.2 U401.6(!CTS)
FT_RXD: U401.4(RXD) U403.6(B:B2)
FT_TXD: U401.1(TXD) U403.3(A:B2)
FT_USB_D+: J405.3(D+) U401.8(USBDP)
FT_USB_D-: J405.2(D-) U401.9(USBDM)
FT_USB_VBUS: J405.1(VBUS) SJ402.1
FT_VBUS_SENSE: SJ402.2 U401.14(CBUS1)
GND: A400.16(GND) A400.50(GND) A400.G1(GND) A400.G2(GND) C400.2 C401.2 C403.2 C404.2 C405.1 C406.1 C407.2 C408.2 C409.2 C410.2 C411.2 C412.2 C413.2 C414.2 C415.2 C416.2 D400.3(C) J400.3 J403.1 J404.1 J405.5(GND) J405.S1(GND) J405.S2(GND) J405.S3(GND) J405.S4(GND) J406.5(GND) J406.S1(GND) J406.S2(GND) J406.S3(GND) J406.S4(GND) J408.1 Q400.2(S) Q401.2(S) Q402.2(S) Q403.2(S) Q404.2(S) Q405.2(S) Q406.2(S) R402.1 R403.1 RV400.1(A) RV401.1(A) SW400.2 SW401.2 SW402.2 SW403.2 SW404.2 SW405.2 SW406.2 SW407.2(P) SW409.1 U400.13(VSS) U400.31(AVSS) U400.36(VSS) U400.45(VSS) U400.52(VUSB3V3) U400.53(VSS) U400.63(VSS) U400.75(VSS) U400.84(VSS) U400.92(VSS) U401.5(GND) U401.13(GND) U403.8(M:GND) U403.15(M:!OE) U404.4(A:V-) XDS400.1(GND) ; also sheet 1,2,3
I2S_LRCLK: A400.2(RFS1) U400.79(RD12) ; also sheet 3
I2S_SCLK: A400.3(SCLK1) U400.76(RD1) ; also sheet 3
I2S_SD: A400.4(DT1) U400.77(RD2) ; also sheet 3
LCD_!CS: U400.7(RC2) XDS400.7(!CS)
LCD_!INT: U400.9(RC4) XDS400.8(!INT)
LCD_!PD: U400.8(RC3) XDS400.9(!PD)
LCD_ADD_PIN: U400.2(RA5) XDS400.10(AUDIO_L)
LCD_BL_CTL: Q400.1(G) U400.1(RG15)
LCD_GND_BL: Q400.3(D) XDS400.16(GND_BL) XDS400.18(GND_BL)
LCD_GPIO0: U400.6(RC1) XDS400.11(GPIO0/IO2)
LCD_GPIO1: U400.5(RE7) XDS400.12(GPIO1/IO3)
LCD_GPIO2: U400.4(RE6) XDS400.13(GPIO2)
LCD_GPIO3: U400.3(RE5) XDS400.14(GPIO3)
LCD_MISO: U400.11(RG7) XDS400.5(MISO/IO1)
LCD_MOSI: U400.12(RG8) XDS400.6(MOSI/IO0)
LCD_SCK: U400.10(RG6) XDS400.4(SCK)
LCD_V0: RV401.2(S) XDS400.3(NC1)
LCD_VBL: SJ401.2 XDS400.15(VBL) XDS400.17(VBL)
LED_B: J401.4 Q403.3(D)
LED_G: J401.2 Q401.3(D)
LED_R: J401.3 Q402.3(D)
MCU_!MCLR: J400.1 R401.2 TP400.TP U400.15(!MCLR)
MCU_!MCLR!_FILT: C400.1 R400.1 R401.1 SW409.2
MCU_AUX_DETECT: J408.4 U400.73(RC14)
MCU_BACK_SW: SW403.1 U400.97(RG13)
MCU_BAT_SENSE: R411.2 U404.5(B:+IN)
MCU_BAT_SENSE_BUF: C404.1 TP408.TP U400.26(RB6) U404.6(B:-IN) U404.7(B:OUT)
MCU_BAT_SENSE_FB: R411.1 U402.1(A:OUT) U402.2(A:-IN)
MCU_BAT_VDIV: R404.1 R405.2 U402.3(A:+IN)
MCU_CURR_SENSE: R412.1 U404.3(A:+IN)
MCU_CURR_SENSE_+: R409.1 R410.2 U402.5(B:+IN)
MCU_CURR_SENSE_-: R407.2 R408.1 U402.6(B:-IN)
MCU_CURR_SENSE_BUF: C403.1 TP409.TP U400.27(RB7) U404.1(A:OUT) U404.2(A:-IN)
MCU_CURR_SENSE_FB: R407.1 R412.2 U402.7(B:OUT)
MCU_FWD_SW: SW405.1 U400.99(RE3)
MCU_LCD_BL_SW: SW406.1 U400.100(RE4)
MCU_LED_B: Q403.1(G) U400.20(RB5)
MCU_LED_G: Q401.1(G) U400.18(RE8)
MCU_LED_MODE1: SW407.1(O) U400.16(RG9)
MCU_LED_MODE2: SW407.3(S) U400.17(RA0)
MCU_LED_POT: RV400.2(S) U400.21(RB4)
MCU_LED_R: Q402.1(G) U400.19(RE9)
MCU_MFB_SW: SW401.1 U400.95(RG14)
MCU_OSC1: C405.2 U400.49(RC12) Y400.2
MCU_OSC2: R406.2 U400.50(RC15)
MCU_OSC2_R: C406.2 R406.1 Y400.1
MCU_PGC: J400.5 U400.24(RB1)
MCU_PGD: J400.4 U400.25(RB0)
MCU_PLAY_SW: SW404.1 U400.98(RE2)
MCU_SWLED_MAIN: Q404.1(G) U400.22(RB3)
MCU_SWLED_PWR: Q405.1(G) U400.23(RB2)
MCU_UART_RX: U400.81(RD4) U403.5(B:B1)
MCU_UART_TX: U400.82(RD5) U403.2(A:B1)
MCU_VOL+_SW: SW402.1 U400.96(RG12)
MCU_VOL-_SW: SW400.1 U400.94(RE1)
SWLED_MAIN: J402.2 Q404.3(D)
SWLED_PWR: J402.3 Q405.3(D)
VBAT: R404.2 ; also sheet 1
Unconnected: A400.1(DR1) A400.5(MCLK1) A400.6(AOHPR) A400.7(AOHPM) A400.8(AOHPL) A400.9(MICN2) A400.10(MICP2) A400.13(MICN1) A400.14(MICP1) A400.15(MICBIAS) A400.17(DMIC_CLK) A400.18(DMIC1_R) A400.19(DMIC1_L) A400.20(P3_2) A400.21(P2_6) A400.24(SYS_PWR) A400.25(VDD_IO) A400.27(SKI1_AMB_DET) A400.28(SK2_KEY_AD) A400.32(LED1) A400.33(P0_2) A400.34(LED2) A400.35(P0_6) A400.38(P0_3) A400.39(P2_7) A400.40(P0_5) A400.41(P1_6/PWM1) A400.42(P2_3) A400.44(P0_1) A400.45(P0_7) A400.46(P1_2/TDI_CPU/SCL) A400.47(P1_3/TCK_CPU/SDA) A400.48(P3_7/UART_CTS) A400.49(P0_0/UART_TX_IND) J405.4(ID) J406.4(ID) U400.28(RA9) U400.29(RA10) U400.35(RB11) U400.38(RA1) U400.39(RF13) U400.40(RF12) U400.41(RB12) U400.42(RB13) U400.43(RB14) U400.44(RB15) U400.47(RD14) U400.48(RD15) U400.51(VBUS) U400.54(D-) U400.55(D+) U400.56(RF3) U400.57(RF2) U400.72(RC13) U400.78(RD3) U400.86(RF1) U400.87(RG1) U400.88(RG0) U400.89(RA6) U400.90(RA7) U400.91(RE0) U401.2(!RTS) U401.7(CBUS2) U401.11(!RESET) U401.15(CBUS0) U401.16(CBUS3) U403.9(C:A) U403.10(C:B2) U403.11(C:B1) U403.12(D:A) U403.13(D:B2) U403.14(D:B1)

## Library data of the parts
A400 = BW-Active:BM83: Bluetooth audio module
C100-C128 C131-C136 C204-C211 C214-C217 C219-C229 C300-C319 C322-C343 C400-C416 = rcl:C-EU: CAPACITOR, European symbol; SPICEPREFIX: C
C129 C130 C200-C203 C212 C213 C218 C230 C320 C321 C344 = rcl:CPOL-EU: POLARIZED CAPACITOR, European symbol; SPICEPREFIX: C
D100 D101 = BW-Active:SOD323-SCHOTTKY
D102 = BW-Active:SOD323-ZENER
D103 = BW-Active:DO-219AB-ZENER
D200 D201 = BW-Active:TO220AB-HS1-SCHOTTKY
D202 = BW-Active:DO-214AA-SCHOTTKY
D400 = BW-Active:SOT23-TVS
F100 F101 = BW-PassiveMechanical:2410-FUSE
F300 F301 = BW-PassiveMechanical:MRF_FUSE
FAN300 = BW-PassiveMechanical:WIRED-FAN: Simple 2-pin fan with wire/header connections
H300 = BW-PassiveMechanical:ATS-CPX030030030-173-C2-R0: Heatsink 30x30x30mm
J100 = BW-Connectors:TE-770966: 2-pin locking connector, right-angle
J400 = BW-Connectors:5P-1.27-POGO: Pads for 5 pogo pins, 1.27mm pitch
J401 J408 = BW-Connectors:GEN-4PIN
J402 = BW-Connectors:GEN-3PIN
J403 J404 = BW-Connectors:GEN-2PIN
J405 J406 = BW-Connectors:ZX62D-B-5PA8: Micro-USB connector, bottom mount
L100 = BW-PassiveMechanical:PM5022: Med-high current inductor
L200 = BW-PassiveMechanical:PQ2614B: High current inductor
L201 = BW-PassiveMechanical:SRF1280A: Medium current coupled inductor
L202 = BW-PassiveMechanical:SRN1060: Medium current inductor
L203 = BW-PassiveMechanical:RLB0912: Low-med current inductor
L300-L303 = BW-PassiveMechanical:1D14A: High Isat audio inductor
Q100-Q106 Q200 Q201 = BW-Active:TO220BV-HS1-N-MOSFET
Q202 = BW-Active:SOT669-N-MOSFET
Q203 = BW-Active:SOT23-P-MOSFET
Q400-Q406 = BW-Active:SOT23-N-MOSFET
R100-R128 R200-R211 R213-R221 R300-R313 R400-R414 = resistor:R-US_: RESISTOR, American symbol
R212 = BW-PassiveMechanical:R-US_R0612
RT300 = BW-PassiveMechanical:WIRED-THERMISTOR: Thermistor with wire/header connections
RV200 RV401 = BW-PassiveMechanical:TC33X-2: 3mm SMD trimmer potentiometer
RV400 = BW-PassiveMechanical:WIRED-POTENTIOMETER: Potentiometer with wire/header connections
SJ300 SJ402 = jumper:SJ: SMD solder JUMPER
SJ301 SJ400 SJ401 = jumper:SJ2W: SMD solder JUMPER
SW100 SW400-SW406 SW409 = BW-PassiveMechanical:WIRED-SWITCH-NO: Normally open switch with wire/header connections
SW407 = BW-PassiveMechanical:WIRED-SWITCH-U: Double-throw switch with wire/header connections
SW408 = BW-PassiveMechanical:SDA01H1S: 1-position DIP switch, SMD
TP100 = testpad:TP: Test pad; TP_SIGNAL_NAME: VIN
TP101 = testpad:TP: Test pad; TP_SIGNAL_NAME: VBAT
TP102 = testpad:TP: Test pad; TP_SIGNAL_NAME: VSUP
TP103 TP107-TP109 = testpad:TP: Test pad; TP_SIGNAL_NAME: BAT-
TP104 = testpad:TP: Test pad; TP_SIGNAL_NAME: !FULLCHG
TP105 = testpad:TP: Test pad; TP_SIGNAL_NAME: !FASTCHG
TP106 = testpad:TP: Test pad; TP_SIGNAL_NAME: CHG_!FAULT
TP200 = testpad:TP: Test pad; TP_SIGNAL_NAME: PVDD
TP201 = testpad:TP: Test pad; TP_SIGNAL_NAME: 12V
TP202 = testpad:TP: Test pad; TP_SIGNAL_NAME: 5V
TP203 = testpad:TP: Test pad; TP_SIGNAL_NAME: 3.6V
TP204 = testpad:TP: Test pad; TP_SIGNAL_NAME: 3.3V
TP300 = testpad:TP: Test pad; TP_SIGNAL_NAME: EMO1
TP301 = testpad:TP: Test pad; TP_SIGNAL_NAME: DSP_!RESET
TP302 = testpad:TP: Test pad; TP_SIGNAL_NAME: DSP_!PDN
TP303 = testpad:TP: Test pad; TP_SIGNAL_NAME: !MUTE
TP304 = testpad:TP: Test pad; TP_SIGNAL_NAME: SDA
TP305 = testpad:TP: Test pad; TP_SIGNAL_NAME: SCL
TP306 = testpad:TP: Test pad; TP_SIGNAL_NAME: LRCLK
TP307 = testpad:TP: Test pad; TP_SIGNAL_NAME: SCLK
TP308 = testpad:TP: Test pad; TP_SIGNAL_NAME: SD
TP309 = testpad:TP: Test pad; TP_SIGNAL_NAME: VALID
TP310 = testpad:TP: Test pad; TP_SIGNAL_NAME: !BKND_ERR
TP311 = testpad:TP: Test pad; TP_SIGNAL_NAME: OUT_A
TP312 = testpad:TP: Test pad; TP_SIGNAL_NAME: OUT_B
TP313 = testpad:TP: Test pad; TP_SIGNAL_NAME: OUT_C
TP314 = testpad:TP: Test pad; TP_SIGNAL_NAME: OUT_D
TP315 = testpad:TP: Test pad; TP_SIGNAL_NAME: SPK_A
TP316 = testpad:TP: Test pad; TP_SIGNAL_NAME: SPK_B
TP317 = testpad:TP: Test pad; TP_SIGNAL_NAME: SPK_C
TP318 = testpad:TP: Test pad; TP_SIGNAL_NAME: SPK_D
TP319 = testpad:TP: Test pad; TP_SIGNAL_NAME: THERM
TP320 = testpad:TP: Test pad; TP_SIGNAL_NAME: FAN
TP321 = testpad:TP: Test pad; TP_SIGNAL_NAME: AMP_!RESET
TP400 = testpad:TP: Test pad; TP_SIGNAL_NAME: !MCLR
TP408 = testpad:TP: Test pad; TP_SIGNAL_NAME: BATT_SENSE
TP409 = testpad:TP: Test pad; TP_SIGNAL_NAME: CURR_SENSE
TP410 = testpad:TP: Test pad; TP_SIGNAL_NAME: BM_RX
TP411 = testpad:TP: Test pad; TP_SIGNAL_NAME: BM_TX
TP412 = testpad:TP: Test pad; TP_SIGNAL_NAME: MFB
TP413 = testpad:TP: Test pad; TP_SIGNAL_NAME: BM_!RST
U100 = BW-Active:BQ77915: 3-5s Lithium battery protection & management
U101 = BW-Active:MAX1737: 1-4s lithium battery charge controller
U102-U104 = BW-Active:LM74700-Q1: Ideal diode controller
U200 = BW-Active:LM5022: Boost controller
U201 = BW-Active:LM3488: Boost/SEPIC/Flyback switching controller
U202 = BW-Active:LM25085: Buck controller
U203 = BW-Active:TPS54308: 3A FCCM Step-Down Converter
U204 = BW-Active:DPAK-LDO
U300 = BW-Active:TAS5548: 8-channel I2S/PWM Digital Audio Processor
U301 = BW-Active:TAS5634: Audio PWM Amplifier Power Stage
U302 = BW-Active:NCS20071: Single-channel medium-power OpAmp
U400 = BW-Active:PIC32MZ-EF-100: 32-bit 200MHz microcontroller, 100-pin
U401 = ftdichip:FT230X: USB to BASIC UART IC Auto generated by make-symbol-device-package-bsdl.ulp Rev. 43 Source: Data sheet <http://www.ftdichip.com/Support/Documents/DataSheets/ICs/DS_FT230X.pdf>
U402 U404 = BW-Active:NCS2333: Dual op amp, very low offset voltage
U403 = BW-Active:FSAL200: Quad 2:1 analog multiplexer
XBT100 = BW-Connectors:LI-ION-PACK-CONN: 4s Li-Ion battery pack connector with integrated thermistor
XDS400 = BW-Active:NHD-3.5-320240FT: SPI 3.5" LCD, 320x240, resistive touch
XLS300-XLS302 = BW-Connectors:SPEAKER-CONN
Y300 Y400 = BW-PassiveMechanical:HC49US-CRYSTAL